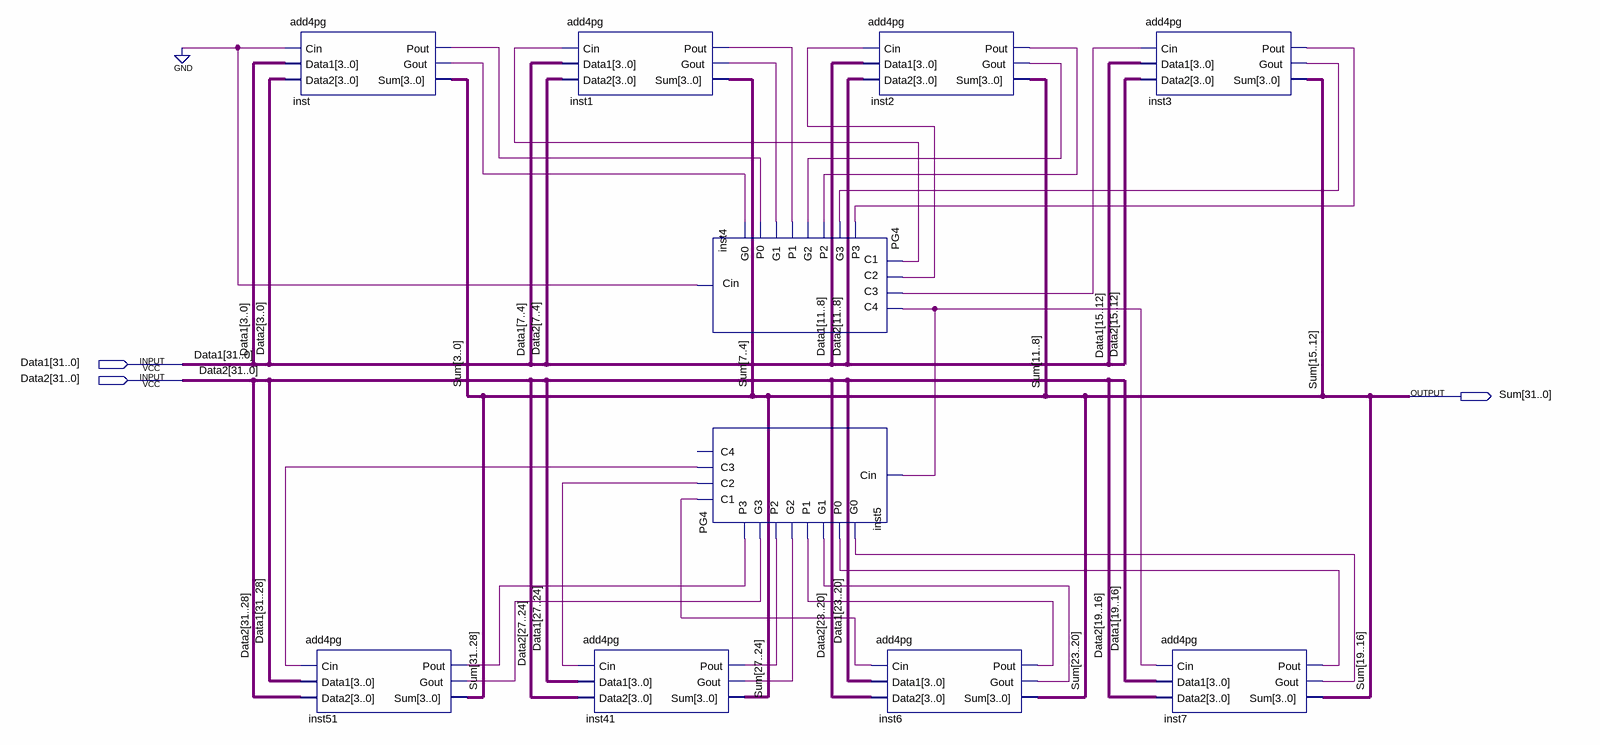
[diagram p0: schematic sheet]
// Quartus schematic Adder.bdf as structural Verilog: 10 symbols, 3 pins
module Adder (
  input  [31:0] Data1,
  input  [31:0] Data2,
  output [31:0] Sum
);

  wire inst1_gout, inst1_pout, inst2_gout, inst2_pout, inst3_gout, inst3_pout, inst4_c1, inst4_c2, inst4_c3,
       inst4_c4, inst5_c1, inst5_c2, inst5_c3, inst6_gout, inst6_pout, inst7_gout, inst7_pout, inst41_gout,
       inst41_pout, inst51_gout, inst51_pout, inst_gout, inst_pout;

  add4pg inst (.Cin(1'b0), .Data1(Data1[3:0]), .Data2(Data2[3:0]), .Pout(inst_pout), .Gout(inst_gout), .Sum(Sum[3:0]));
  add4pg inst51 (
    .Cin(inst5_c3), .Data1(Data1[31:28]), .Data2(Data2[31:28]), .Pout(inst51_pout), .Gout(inst51_gout),
    .Sum(Sum[31:28]));
  add4pg inst1 (
    .Cin(inst4_c1), .Data1(Data1[7:4]), .Data2(Data2[7:4]), .Pout(inst1_pout), .Gout(inst1_gout),
    .Sum(Sum[7:4]));
  add4pg inst41 (
    .Cin(inst5_c2), .Data1(Data1[27:24]), .Data2(Data2[27:24]), .Pout(inst41_pout), .Gout(inst41_gout),
    .Sum(Sum[27:24]));
  PG4 inst4 (
    .Cin(1'b0), .P3(inst3_pout), .G3(inst3_gout), .P2(inst2_pout), .G2(inst2_gout), .P1(inst1_pout),
    .G1(inst1_gout), .P0(inst_pout), .G0(inst_gout), .C1(inst4_c1), .C2(inst4_c2), .C3(inst4_c3),
    .C4(inst4_c4));
  PG4 inst5 (
    .Cin(inst4_c4), .P3(inst51_pout), .G3(inst51_gout), .P2(inst41_pout), .G2(inst41_gout), .P1(inst6_pout),
    .G1(inst6_gout), .P0(inst7_pout), .G0(inst7_gout), .C1(inst5_c1), .C2(inst5_c2), .C3(inst5_c3));  // open: C4
  add4pg inst2 (
    .Cin(inst4_c2), .Data1(Data1[11:8]), .Data2(Data2[11:8]), .Pout(inst2_pout), .Gout(inst2_gout),
    .Sum(Sum[11:8]));
  add4pg inst6 (
    .Cin(inst5_c1), .Data1(Data1[23:20]), .Data2(Data2[23:20]), .Pout(inst6_pout), .Gout(inst6_gout),
    .Sum(Sum[23:20]));
  add4pg inst3 (
    .Cin(inst4_c3), .Data1(Data1[15:12]), .Data2(Data2[15:12]), .Pout(inst3_pout), .Gout(inst3_gout),
    .Sum(Sum[15:12]));
  add4pg inst7 (
    .Cin(inst4_c4), .Data1(Data1[19:16]), .Data2(Data2[19:16]), .Pout(inst7_pout), .Gout(inst7_gout),
    .Sum(Sum[19:16]));
endmodule
